# Altium schematic sheet 7I92FPGA.SchDoc
size D
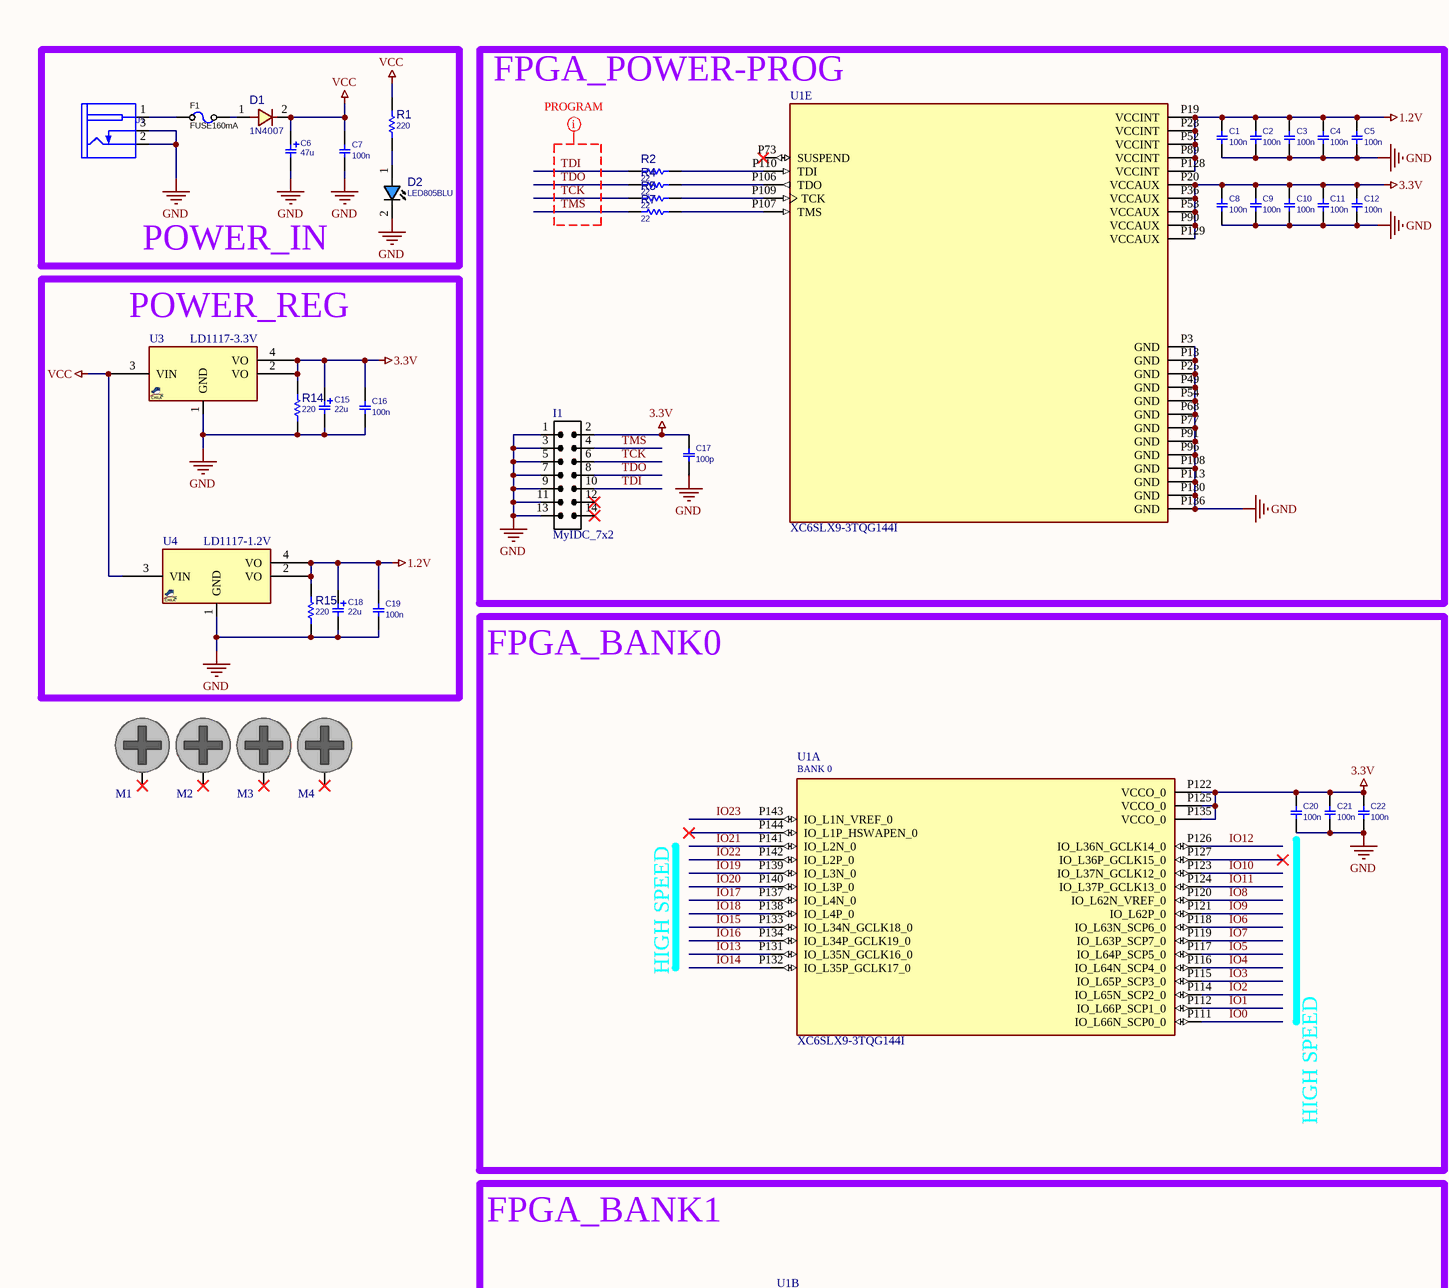
[diagram p0: 7I92FPGA.SchDoc, top left]
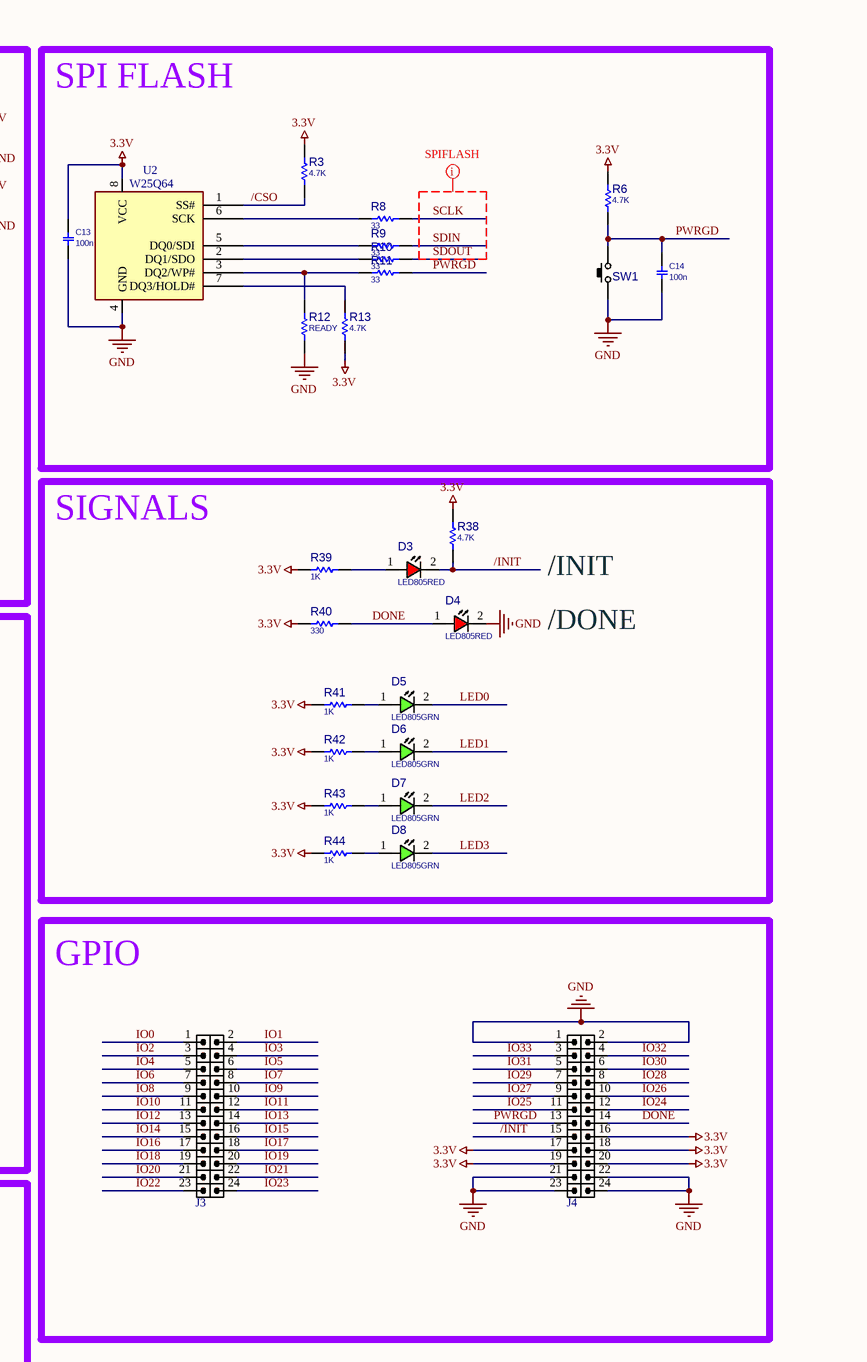
[diagram p1: 7I92FPGA.SchDoc, top middle]
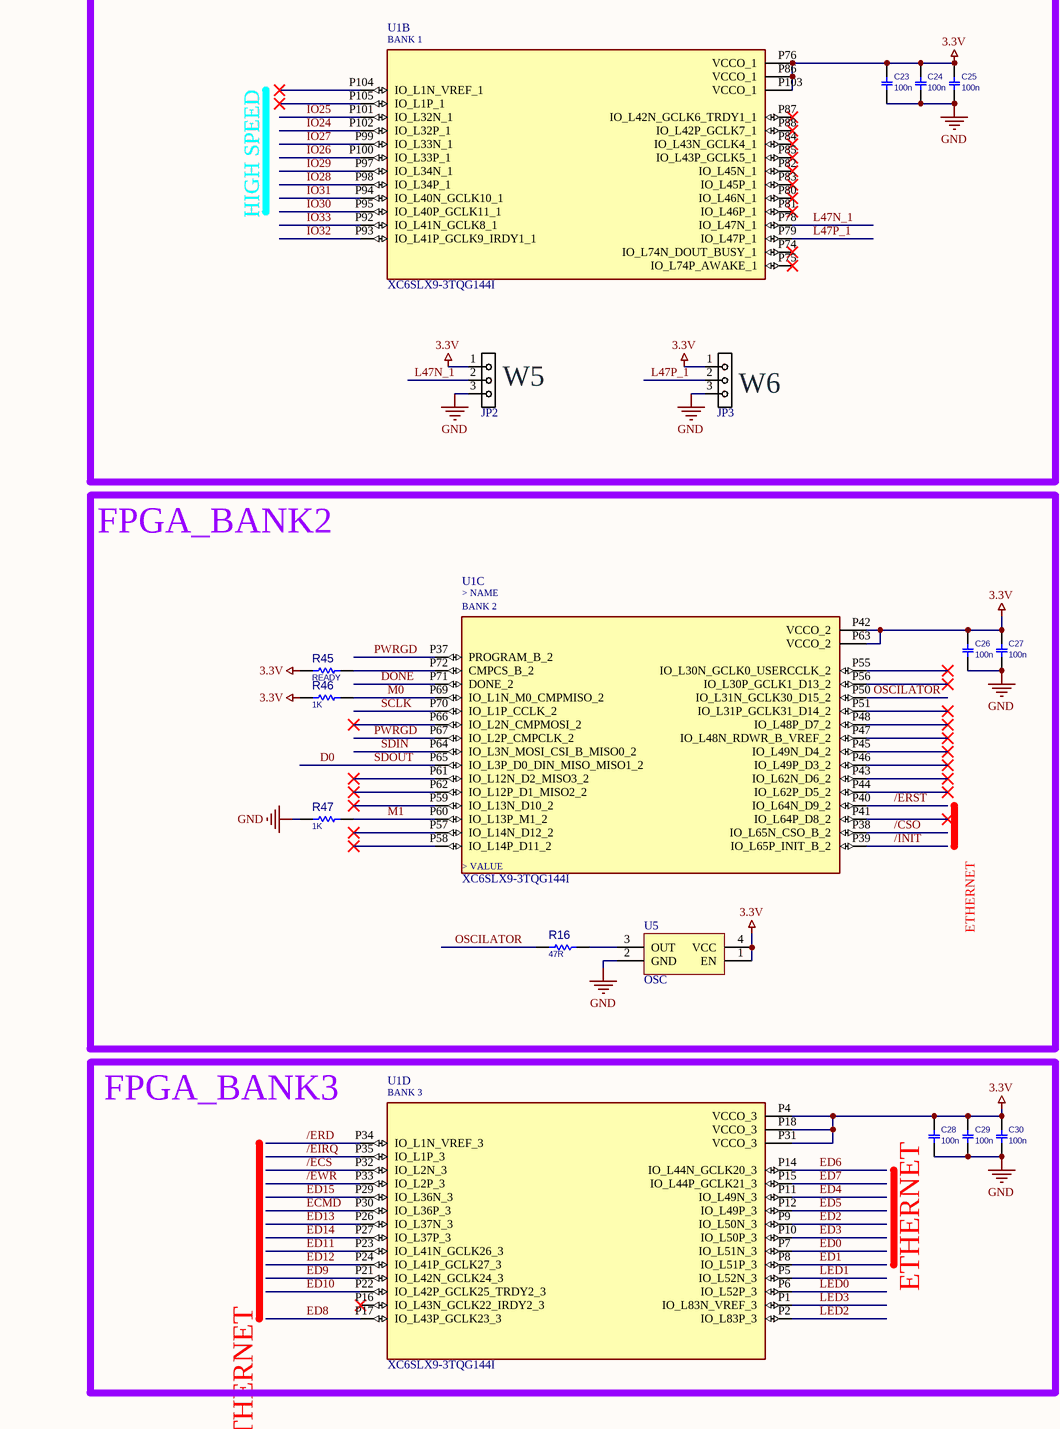
[diagram p2: 7I92FPGA.SchDoc, bottom left]
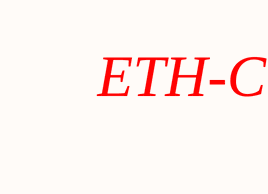
[diagram p3: 7I92FPGA.SchDoc, bottom right]

## Parts
C1  100n  [C0603]
C2  100n  [C0603]
C3  100n  [C0603]
C4  100n  [C0603]
C5  100n  [C0603]
C6  47u  [C_TN_3216]
C7  100n  [C0805]
C8  100n  [C0603]
C9  100n  [C0603]
C10  100n  [C0603]
C11  100n  [C0603]
C12  100n  [C0603]
C13  100n  [C0603]
C14  100n  [C0603]
C15  22u  [C_TN_3216]
C16  100n  [C0805]
C17  100p  [C0603]
C18  22u  [C_TN_3216]
C19  100n  [C0805]
C20  100n  [C0603]
C21  100n  [C0603]
C22  100n  [C0603]
C23  100n  [C0603]
C24  100n  [C0603]
C25  100n  [C0603]
C26  100n  [C0603]
C27  100n  [C0603]
C28  100n  [C0603]
C29  100n  [C0603]
C30  100n  [C0603]
D1  1N4007  [D_SMA]
D2  LED805BLU  [LED0805BLU]
D3  LED805RED  [LED0805RED]
D4  LED805RED  [LED0805RED]
D5  LED805GRN  [LED0805GRN]
D6  LED805GRN  [LED0805GRN]
D7  LED805GRN  [LED0805GRN]
D8  LED805GRN  [LED0805GRN]
F1  FUSE160mA  [F1206]
I1  MyIDC_7x2  [myIDC_7x2]
J1  DC_POWER_JACK  [JAC_PWR2]  (value not drawn)
J3  HDRM_2X12  [HDR_M_2X12]  (value not drawn)
J4  HDRM_2X12  [HDR_M_2X12]  (value not drawn)
JP2  JMPHDR3PIN  [JP_3]  (value not drawn)
JP3  JMPHDR3PIN  [JP_3]  (value not drawn)
M1  DNP/MH  [SCMH_M4C]  (value not drawn)  (no BOM)
M2  DNP/MH  [SCMH_M4C]  (value not drawn)  (no BOM)
M3  DNP/MH  [SCMH_M4C]  (value not drawn)  (no BOM)
M4  DNP/MH  [SCMH_M4C]  (value not drawn)  (no BOM)
R1  220  [R0805]
R2  22  [R0603]
R3  4.7K  [R0603]
R4  22  [R0603]
R5  22  [R0603]
R6  4.7K  [R0603]
R7  22  [R0603]
R8  33  [R0603]
R9  33  [R0603]
R10  33  [R0603]
R11  33  [R0603]
R12  READY  [R0603]
R13  4.7K  [R0603]
R14  220  [R0805]
R15  220  [R0805]
R16  47R  [R0603]
R38  4.7K  [R0603]
R39  1K  [R0603]
R40  330  [R0603]
R41  1K  [R0603]
R42  1K  [R0603]
R43  1K  [R0603]
R44  1K  [R0603]
R45  READY  [R0603]
R46  1K  [R0603]
R47  1K  [R0603]
SW1  PUSHBUTTON  [SWPBS_SPST_6X3X5]  (value not drawn)
U1  XC6SLX9-3TQG144I  [QFP50P2200X2200X160-144N]  (parts A,B,C,D,E of 5)
U2  W25Q64  [SO_8_W]
U3  LD1117-3.3V  [SOT223_4]
U4  LD1117-1.2V  [SOT223_4]
U5  OSC  [XTL_4_7050GEN]

## Blocks framed on the sheet
POWER_IN: C6 C7 D1 D2 F1 J1 R1
FPGA_POWER-PROG: C1-C5 C8-C12 C17 I1 R2 R4 R5 R7 U1
SPI FLASH: C13 C14 R3 R6 R8-R13 SW1 U2
POWER_REG: C15 C16 C18 C19 R14 R15 U3 U4
SIGNALS: D3-D8 R38-R44
FPGA_BANK0: C20-C22 U1
GPIO: J3 J4
FPGA_BANK1: C23-C25 JP2 JP3 U1
FPGA_BANK2: C26 C27 R16 R45-R47 U1 U5
FPGA_BANK3: C28-C30 U1

## Nets
1.2V: C1.1 C2.1 C3.1 C4.1 C5.1 C18.1 C19.1 R15.1 U1.P19(VCCINT) U1.P28(VCCINT) U1.P52(VCCINT) U1.P89(VCCINT) U1.P128(VCCINT) U4.2(VO) U4.4(VO)
3.3V: C8.1 C9.1 C10.1 C11.1 C12.1 C13.1 C15.1 C16.1 C17.1 C20.1 C21.1 C22.1 C23.1 C24.1 C25.1 C26.1 C27.1 C28.1 C29.1 C30.1 I1.2 J4.16 J4.17 J4.18 J4.19 J4.20 JP2.1 JP3.1 R3.2 R6.2 R13.1 R14.1 R38.1 R39.2 R40.2 R41.2 R42.2 R43.2 R44.2 R45.2 R46.2 U1.P4(VCCO_3) U1.P18(VCCO_3) U1.P20(VCCAUX) U1.P31(VCCO_3) U1.P36(VCCAUX) U1.P42(VCCO_2) U1.P53(VCCAUX) U1.P63(VCCO_2) U1.P76(VCCO_1) U1.P86(VCCO_1) U1.P90(VCCAUX) U1.P103(VCCO_1) U1.P122(VCCO_0) U1.P125(VCCO_0) U1.P129(VCCAUX) U1.P135(VCCO_0) U2.8(VCC) U3.2(VO) U3.4(VO) U5.1(EN) U5.4(VCC)
GND: C1.2 C2.2 C3.2 C4.2 C5.2 C6.2 C7.2 C8.2 C9.2 C10.2 C11.2 C12.2 C13.2 C14.2 C15.2 C16.2 C17.2 C18.2 C19.2 C20.2 C21.2 C22.2 C23.2 C24.2 C25.2 C26.2 C27.2 C28.2 C29.2 C30.2 D2.2(CATHODE) D4.2(CATHODE) I1.1 I1.3 I1.5 I1.7 I1.9 I1.11 I1.13 J1.2(SLEEVE) J1.3(INSERTION_DET) J4.1 J4.2 J4.21 J4.22 J4.23 J4.24 JP2.3 JP3.3 R12.1 R14.2 R15.2 R47.2 SW1.1(P1) U1.P3(GND) U1.P13(GND) U1.P25(GND) U1.P49(GND) U1.P54(GND) U1.P68(GND) U1.P77(GND) U1.P91(GND) U1.P96(GND) U1.P108(GND) U1.P113(GND) U1.P130(GND) U1.P136(GND) U2.4(GND) U3.1(GND) U4.1(GND) U5.2(GND)
VCC: C6.1 C7.1 D1.2 R1.1 U3.3(VIN) U4.3(VIN)
/CSO: R3.1 U1.P38(IO_L65N_CSO_B_2) U2.1(SS#)
/ECS: U1.P32(IO_L2N_3)
/EIRQ: U1.P35(IO_L1P_3)
/ERD: U1.P34(IO_L1N_VREF_3)
/ERST: U1.P40(IO_L64N_D9_2)
/EWR: U1.P33(IO_L2P_3)
/INIT: D3.2(CATHODE) J4.15 R38.2 U1.P39(IO_L65P_INIT_B_2)
D0: R10.1 U1.P65(IO_L3P_D0_DIN_MISO_MISO1_2)  [also labelled SDOUT]
DONE: D4.1(ANODE) J4.14 R40.1 U1.P71(DONE_2)
ECMD: U1.P30(IO_L36P_3)
ED0: U1.P7(IO_L51N_3)
ED1: U1.P8(IO_L51P_3)
ED2: U1.P9(IO_L50N_3)
ED3: U1.P10(IO_L50P_3)
ED4: U1.P11(IO_L49N_3)
ED5: U1.P12(IO_L49P_3)
ED6: U1.P14(IO_L44N_GCLK20_3)
ED7: U1.P15(IO_L44P_GCLK21_3)
ED8: U1.P17(IO_L43P_GCLK23_3)
ED9: U1.P21(IO_L42N_GCLK24_3)
ED10: U1.P22(IO_L42P_GCLK25_TRDY2_3)
ED11: U1.P23(IO_L41N_GCLK26_3)
ED12: U1.P24(IO_L41P_GCLK27_3)
ED13: U1.P26(IO_L37N_3)
ED14: U1.P27(IO_L37P_3)
ED15: U1.P29(IO_L36N_3)
IO0: J3.1 U1.P111(IO_L66N_SCP0_0)
IO1: J3.2 U1.P112(IO_L66P_SCP1_0)
IO2: J3.3 U1.P114(IO_L65N_SCP2_0)
IO3: J3.4 U1.P115(IO_L65P_SCP3_0)
IO4: J3.5 U1.P116(IO_L64N_SCP4_0)
IO5: J3.6 U1.P117(IO_L64P_SCP5_0)
IO6: J3.7 U1.P118(IO_L63N_SCP6_0)
IO7: J3.8 U1.P119(IO_L63P_SCP7_0)
IO8: J3.9 U1.P120(IO_L62N_VREF_0)
IO9: J3.10 U1.P121(IO_L62P_0)
IO10: J3.11 U1.P123(IO_L37N_GCLK12_0)
IO11: J3.12 U1.P124(IO_L37P_GCLK13_0)
IO12: J3.13 U1.P126(IO_L36N_GCLK14_0)
IO13: J3.14 U1.P131(IO_L35N_GCLK16_0)
IO14: J3.15 U1.P132(IO_L35P_GCLK17_0)
IO15: J3.16 U1.P133(IO_L34N_GCLK18_0)
IO16: J3.17 U1.P134(IO_L34P_GCLK19_0)
IO17: J3.18 U1.P137(IO_L4N_0)
IO18: J3.19 U1.P138(IO_L4P_0)
IO19: J3.20 U1.P139(IO_L3N_0)
IO20: J3.21 U1.P140(IO_L3P_0)
IO21: J3.22 U1.P141(IO_L2N_0)
IO22: J3.23 U1.P142(IO_L2P_0)
IO23: J3.24 U1.P143(IO_L1N_VREF_0)
IO24: J4.12 U1.P102(IO_L32P_1)
IO25: J4.11 U1.P101(IO_L32N_1)
IO26: J4.10 U1.P100(IO_L33P_1)
IO27: J4.9 U1.P99(IO_L33N_1)
IO28: J4.8 U1.P98(IO_L34P_1)
IO29: J4.7 U1.P97(IO_L34N_1)
IO30: J4.6 U1.P95(IO_L40P_GCLK11_1)
IO31: J4.5 U1.P94(IO_L40N_GCLK10_1)
IO32: J4.4 U1.P93(IO_L41P_GCLK9_IRDY1_1)
IO33: J4.3 U1.P92(IO_L41N_GCLK8_1)
L47N_1: JP2.2 U1.P78(IO_L47N_1)
L47P_1: JP3.2 U1.P79(IO_L47P_1)
LED0: D5.2(CATHODE) U1.P6(IO_L52P_3)
LED1: D6.2(CATHODE) U1.P5(IO_L52N_3)
LED2: D7.2(CATHODE) U1.P2(IO_L83P_3)
LED3: D8.2(CATHODE) U1.P1(IO_L83N_VREF_3)
M0: R46.1 U1.P69(IO_L1N_M0_CMPMISO_2)
M1: R47.1 U1.P60(IO_L13P_M1_2)
OSCILATOR: R16.1 U1.P50(IO_L31N_GCLK30_D15_2)
PWRGD: C14.1 J4.13 R6.1 R11.1 SW1.2(P3) U1.P37(PROGRAM_B_2) U1.P67(IO_L2P_CMPCLK_2)
SCLK: R8.1 U1.P70(IO_L1P_CCLK_2)
SDIN: R9.1 U1.P64(IO_L3N_MOSI_CSI_B_MISO0_2)
TCK: I1.6 R5.2
TDI: I1.10 R2.2
TDO: I1.8 R4.2
TMS: I1.4 R7.2
NetD1_1: D1.1 F1.2
NetD2_1: D2.1(ANODE) R1.2
NetD3_1: D3.1(ANODE) R39.1
NetD5_1: D5.1(ANODE) R41.1
NetD6_1: D6.1(ANODE) R42.1
NetD7_1: D7.1(ANODE) R43.1
NetD8_1: D8.1(ANODE) R44.1
NetF1_1: F1.1 J1.1(TIP)
NetR2_1: R2.1 U1.P110(TDI)
NetR4_1: R4.1 U1.P106(TDO)
NetR5_1: R5.1 U1.P109(TCK)
NetR7_1: R7.1 U1.P107(TMS)
NetR8_2: R8.2 U2.6(SCK)
NetR9_2: R9.2 U2.5(DQ0/SDI)
NetR10_2: R10.2 U2.2(DQ1/SDO)
NetR11_2: R11.2 R12.2 U2.3(DQ2/WP#)
NetR13_2: R13.2 U2.7(DQ3/HOLD#)
NetR16_2: R16.2 U5.3(OUT)
NetR45_1: R45.1 U1.P72(CMPCS_B_2)

Not connected (* = marked no-connect by the designer): I1 12* 14*; M1 1*; M2 1*; M3 1*; M4 1*; U1 P16(IO_L43N_GCLK22_IRDY2_3)* P41(IO_L64P_D8_2)* P43(IO_L62N_D6_2)* P44(IO_L62P_D5_2)* P45(IO_L49N_D4_2)* P46(IO_L49P_D3_2)* P47(IO_L48N_RDWR_B_VREF_2)* P48(IO_L48P_D7_2)* P51(IO_L31P_GCLK31_D14_2)* P55(IO_L30N_GCLK0_USERCCLK_2)* P56(IO_L30P_GCLK1_D13_2)* P57(IO_L14N_D12_2)* P58(IO_L14P_D11_2)* P59(IO_L13N_D10_2)* P61(IO_L12N_D2_MISO3_2)* P62(IO_L12P_D1_MISO2_2)* P66(IO_L2N_CMPMOSI_2)* P73(SUSPEND)* P74(IO_L74N_DOUT_BUSY_1)* P75(IO_L74P_AWAKE_1)* P80(IO_L46N_1)* P81(IO_L46P_1)* P82(IO_L45N_1)* P83(IO_L45P_1)* P84(IO_L43N_GCLK4_1)* P85(IO_L43P_GCLK5_1)* P87(IO_L42N_GCLK6_TRDY1_1)* P88(IO_L42P_GCLK7_1)* P104(IO_L1N_VREF_1)* P105(IO_L1P_1)* P127(IO_L36P_GCLK15_0)* P144(IO_L1P_HSWAPEN_0)*

## Layout directives
net class SPIFLASH: SCLK, SDIN, SDOUT
net class PROGRAM: TCK, TDI, TDO, TMS

## Notes on the sheet
- /INIT
- /DONE
- HIGH SPEED
- (near JP2) W5
- (near JP3) W6
- ETHERNET
- ETH-CTRLCNC
- (in symbol XC6SLX9-3TQG144I, part A) BANK 0
- (in symbol XC6SLX9-3TQG144I, part B) BANK 1
- (in symbol XC6SLX9-3TQG144I, part C) > NAME; BANK 2; > VALUE
- (in symbol XC6SLX9-3TQG144I, part D) BANK 3

## Library data of the parts
C1-C5 C7-C14 C16 C17 C19-C30 = CAP_SMD_MLCC: CAP, MLCC, 1nF, 50V, C0G, 10%, 0402; MANF: Murata; PARAM: C0G, 10%; PRICE: 100= 1.4$; DESC: -; MANF_P#: -; PARAM2: 50V; ASSEMBLY: ASSEMBLY
  C1-C5 C7-C14 C16 C19-C30: VALUE: 100n
  C17: VALUE: 100p
C6 C15 C18 = CAP_SMD_TAN: CAP, SMD, TAN,; PARAM: 25V
  C6: VALUE: 47u
  C15 C18: VALUE: 22u
D1 = DIODE_SMD_1N4007: DIODE, GENERAL PURPOSE, 1000V/1A; MANF: Kingtronics; DESC: DESCRIPTION; PARAM: 1000V VRRM; PARAM2: 1A; MANF_P#: M7; ASSEMBLY: ASSEMBLY; PRICE: PRICE; VALUE: 1N4007
D2 = LED_SMD_0805_BLU: LED, SMD, 0805, BLUE; DESC: DESCRIPTION; MANF_P#: MANF_PART#; PARAM2: 2.2V; MANF: MANF; ASSEMBLY: ASSEMBLY; PRICE: 36t@Javan; VALUE: LED805BLU
D3 D4 = LED_SMD_0805_RED: LED, SMD, 0805, RED; DESC: DESCRIPTION; MANF_P#: MANF_PART#; PARAM2: 2.2V; MANF: MANF; ASSEMBLY: ASSEMBLY; PRICE: 36t@Javan; VALUE: LED805RED
D5-D8 = LED_SMD_0805_GRN: LED, SMD, 0805, GREEN; PARAM: 20mA; DESC: DESCRIPTION; PARAM2: 2.2V; MANF: -; ASSEMBLY: ASSEMBLY; PRICE: 36t@Javan; MANF_P#: -; VALUE: LED805GRN
F1 = FUSE_160mA_1206: Fuse, 160mA, 63VDC, 1206, SMD, Fast Acting; PARAM: 160mA; 63VDC; slow-blow; MANF: Holly Fuse; MANF_P#: 12T-0160L; PARAM2: PARAM2; VALUE: FUSE160mA
J1 = CONN_PWR_JACKR2: CONN, PWR JACK DC, PLUG DIAM 2.0MM RA THD; MANF: CUI STACK; MANF_P#: PJ-202A, PJ-002AH, PJ-102AH, KLDX-0202; VALUE: DC_POWER_JACK
J3 J4 = HDR_M_2X12: CONN, HEADER, Male, pitch: 2.54mm, 24POS; VALUE: HDRM_2X12
JP2 JP3 = JUMPER_HDR_3P: JUMPER, HEADER 3PIN; MANF: MANF; MANF_P#: MANF_P#; VALUE: JMPHDR3PIN
M1-M4 = SCMH_M4C: SCREW mouting, M4, 4mm diameter and 8.0mm CheeseHead; ASSEMBLY: DNP; VALUE: DNP/MH
R1-R16 R38-R47 = RES_SMD: RESISTOR, SMD; MANF_P#: RK73H1ETTP4701F; MANF: KOA SPEER; PARAM: 0.063W; DESC: DESCRIPTION; DIST#: MOUSER; PARAM2: 1%; ASSEMBLY: ASSEMBLY; PRICE: 100= 0.5$
  R1 R14 R15: VALUE: 220
  R2 R4 R5 R7: VALUE: 22
  R3 R6 R13 R38: VALUE: 4.7K
  R8-R11: VALUE: 33
  R12 R45: VALUE: READY
  R16: VALUE: 47R
  R39 R41-R44 R46 R47: VALUE: 1K
  R40: VALUE: 330
SW1 = SWPBS_SPST_6X3X4: SWITCH, PUSH BUTTON, TACTILE, SMD, SPST, 6X3.5X4.3mm; MANF: Panasonic; DESC: DESCRIPTION; MANF_P#: EVQ-PNF04M; VALUE: PUSHBUTTON; ASSEMBLY: ASSEMBLY; PARAM: PARAM; PRICE: PRICE
U1 = XC6SLX9-3TQG144I: FPGA Spartan-6 LX Family 9152 Cells 45nm (CMOS) Technology 1.2V 144-Pin TQFP; MF: {'manufacturer': u'Xilinx Inc.'}; MP: XC6SLX9-3TQG144I; Availability: Unavailable; Package: None; Value: *; Price: None
U2 = W25Q64FV_SO8W: SPI FLASH Memory, 64Mb (8M x8), 104MHz; MANF: WINBOND; MANF_P#: W25Q64FVSSIG; PARAM2: 2.7~3.6V; PARAM: 64Mb (8M x8), 104MHz; PRICE: 1$; VALUE: W25Q64
U3 U4 = VREG_1117_SOT223: REG, Linear, LDO1V, 0.8A, SOT-223; MANF_P#: LD1117, LM1117, AMS1117, TLV1117, REG1117, NCP1117, LT1117, SPX1117; MANF: TI, ON, ST; PARAM2: 1.2/1.5/1.8/2.5/2.85/3.3/5V; PARAM: LDO1V, 0.8A
  U3: VALUE: LD1117-3.3V
  U4: VALUE: LD1117-1.2V
U5 = OSC (SMD)